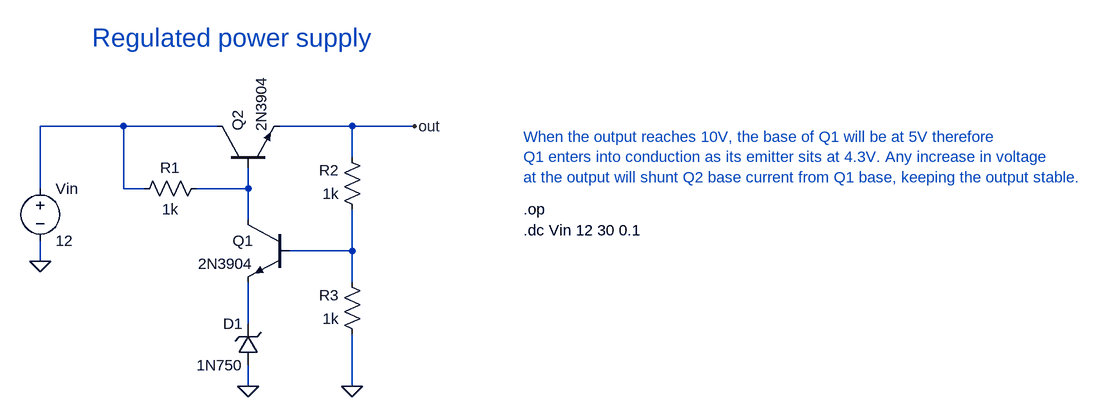
[diagram p0: schematic Figure2.75.asc]
Figure2.75.asc, the LTspice schematic file:
Version 4
SHEET 1 1528 680
WIRE -32 48 -160 48
WIRE 112 48 -32 48
WIRE 320 48 208 48
WIRE 416 48 320 48
WIRE 320 96 320 48
WIRE -160 144 -160 48
WIRE -32 144 -32 48
WIRE 0 144 -32 144
WIRE 160 144 160 112
WIRE 160 144 80 144
WIRE 160 192 160 144
WIRE 320 240 320 176
WIRE 320 240 224 240
WIRE -160 256 -160 224
WIRE 320 288 320 240
WIRE 160 352 160 288
WIRE 160 448 160 416
WIRE 320 448 320 368
FLAG 160 448 0
FLAG 320 448 0
FLAG -160 256 0
FLAG 416 48 out
SYMBOL npn 224 192 M0
SYMATTR InstName Q1
SYMATTR Value 2N3904
SYMBOL res 96 128 R90
WINDOW 0 0 56 VBottom 2
WINDOW 3 32 56 VTop 2
SYMATTR InstName R1
SYMATTR Value 1k
SYMBOL res 336 192 R180
WINDOW 0 36 76 Left 2
WINDOW 3 36 40 Left 2
SYMATTR InstName R2
SYMATTR Value 1k
SYMBOL res 336 384 R180
WINDOW 0 36 76 Left 2
WINDOW 3 36 40 Left 2
SYMATTR InstName R3
SYMATTR Value 1k
SYMBOL zener 176 416 R180
WINDOW 0 24 64 Left 2
WINDOW 3 24 0 Left 2
SYMATTR InstName D1
SYMATTR Value 1N750
SYMBOL voltage -160 128 R0
WINDOW 123 0 0 Left 0
WINDOW 39 0 0 Left 0
SYMATTR InstName Vin
SYMATTR Value 12
SYMBOL npn 112 112 R270
SYMATTR InstName Q2
SYMATTR Value 2N3904
TEXT 584 176 Left 2 !.op
TEXT 584 208 Left 2 !.dc Vin 12 30 0.1
TEXT -80 -88 Left 4 ;Regulated power supply
TEXT 584 64 Left 2 ;When the output reaches 10V, the base of Q1 will be at 5V therefore\nQ1 enters into conduction as its emitter sits at 4.3V. Any increase in voltage\nat the output will shunt Q2 base current from Q1 base, keeping the output stable.

The netlist it stands for:
* Figure2.75.asc
Q1 N002 N003 N004 0 2N3904
R1 N002 N001 1k
R2 N003 out 1k
R3 0 N003 1k
D1 0 N004 1N750
Vin N001 0 12
Q2 N001 N002 out 0 2N3904
.model D D
.lib standard.dio
.model NPN NPN
.model PNP PNP
.lib standard.bjt
.op
.dc Vin 12 30 0.1
* Regulated power supply
* When the output reaches 10V, the base of Q1 will be at 5V therefore
* Q1 enters into conduction as its emitter sits at 4.3V. Any increase in voltage
* at the output will shunt Q2 base current from Q1 base, keeping the output stable.
.backanno
.end